# Altium project SkyDriver飞行控制器-IMU板V2.PrjPCB
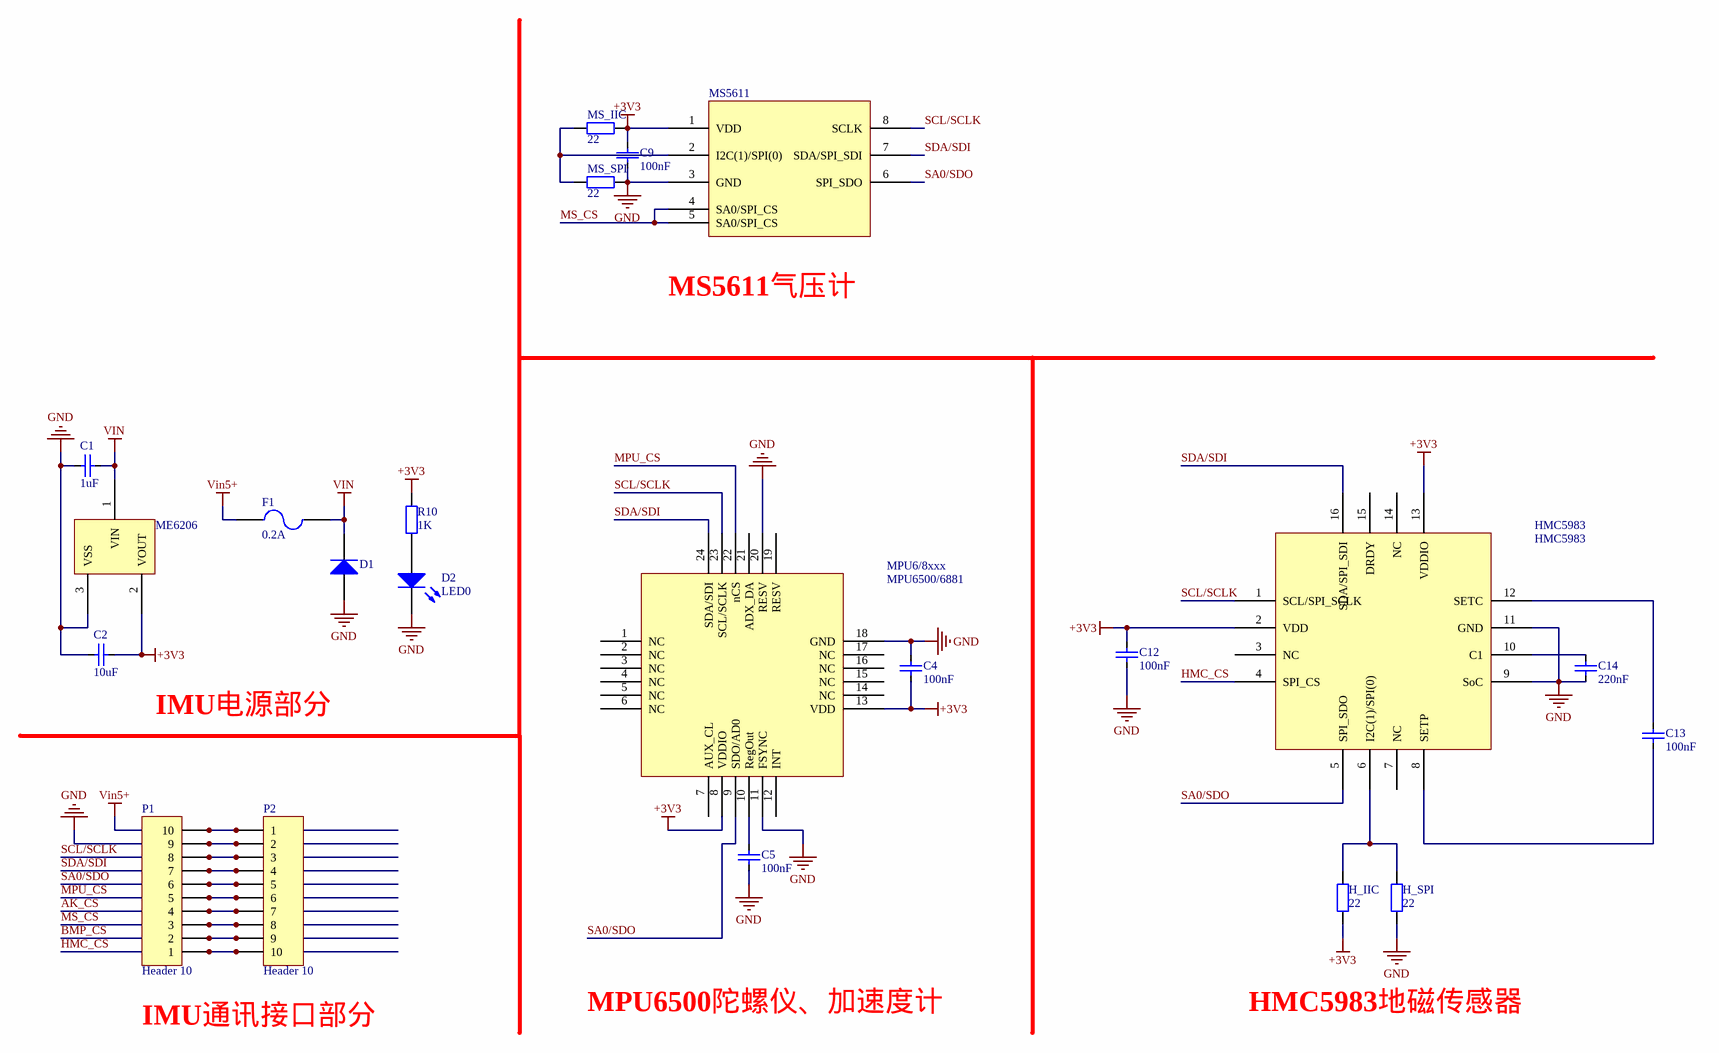
[diagram p0: SkyDriver飞行控制器-IMU板V2.SchDoc]
1 sheet, 22 parts. Net scope: global (net labels, ports and power ports of the same name join across sheets).
Board file: SkyDriver飞行控制器-IMU板V2.PcbDoc

## Sheet SkyDriver飞行控制器-IMU板V2.SchDoc
size A3

### Parts
C1  value 1uF  [CAP_0603]  (hidden comment: Cap_0603)
C2  value 10uF  [CAP_0603]  (hidden comment: Cap_0603)
C4  value 100nF  [CAP_0603]  (hidden comment: Cap_0603)
C5  value 100nF  [CAP_0603]  (hidden comment: Cap_0603)
C9  value 100nF  [CAP_0603]  (hidden comment: Cap_0603)
C12  value 100nF  [CAP_0603]  (hidden comment: Cap_0603)
C13  value 100nF  [CAP_0603]  (hidden comment: Cap_0603)
C14  value 220nF  [CAP_0603]  (hidden comment: Cap_0603)
D1  SS14  [SOD323]  (value not drawn)
D2  LED0  [LED_0805]
F1  value 0.2A  [0805s]  (hidden comment: Fuse)
H_IIC  value 22  [RES_0603]  (hidden comment: Res_0603)
H_SPI  value 22  [RES_0603]  (hidden comment: Res_0603)
HMC5983  HMC5983  [QFN16M - 3*3]
ME6206  ME6206  [sot23_M]  (value not drawn)
MPU6/8xxx  MPU6500/6881  [QFN24M - 3*3]
MS5611  MS5611  [QFN8 - MS5611]  (value not drawn)
MS_IIC  value 22  [RES_0603]  (hidden comment: Res_0603)
MS_SPI  value 22  [RES_0603]  (hidden comment: Res_0603)
P1  Header 10  [FPC0.5 - Header10]
P2  Header 10  [FPC0.5 - Header10]
R10  value 1K  [RES_0603]  (hidden comment: Res_0603)

### Nets
+3V3: C2.1 C4.1 C9.2 C12.2 H_IIC.1 HMC5983.2(VDD) HMC5983.13(VDDIO) ME6206.2(VOUT) MPU6/8xxx.8(VDDIO) MPU6/8xxx.13(VDD) MS5611.1(VDD) MS_IIC.1 R10.2
GND: C1.2 C2.2 C4.2 C5.1 C9.1 C12.1 C14.1 D1.2(A) D2.2(K) H_SPI.1 HMC5983.9(SoC) HMC5983.11(GND) ME6206.3(VSS) MPU6/8xxx.11(FSYNC) MPU6/8xxx.18(GND) MPU6/8xxx.20(RESV) MS5611.3(GND) MS_SPI.1 P1.9 P2.2
VIN: C1.1 D1.1(K) F1.2 ME6206.1(VIN)
Vin5+: F1.1 P1.10 P2.1
AK_CS: P1.4 P2.7
BMP_CS: P1.2 P2.9
HMC_CS: HMC5983.4(SPI_CS) P1.1 P2.10
MPU_CS: MPU6/8xxx.22(nCS) P1.5 P2.6
MS_CS: MS5611.4(SA0/SPI_CS) MS5611.5(SA0/SPI_CS) P1.3 P2.8
SA0/SDO: HMC5983.5(SPI_SDO) MPU6/8xxx.9(SDO/AD0) MS5611.6(SPI_SDO) P1.6 P2.5
SCL/SCLK: HMC5983.1(SCL/SPI_SCLK) MPU6/8xxx.23(SCL/SCLK) MS5611.8(SCLK) P1.8 P2.3
SDA/SDI: HMC5983.16(SDA/SPI_SDI) MPU6/8xxx.24(SDA/SDI) MS5611.7(SDA/SPI_SDI) P1.7 P2.4
NetC5_2: C5.2 MPU6/8xxx.10(RegOut)
NetC13_1: C13.1 HMC5983.8(SETP)
NetC13_2: C13.2 HMC5983.12(SETC)
NetC14_2: C14.2 HMC5983.10(C1)
NetD2_1: D2.1(A) R10.1
NetH_IIC_2: H_IIC.2 H_SPI.2 HMC5983.6(I2C(1)/SPI(0))
NetMS5611_2: MS5611.2(I2C(1)/SPI(0)) MS_IIC.2 MS_SPI.2

Not connected (* = marked no-connect by the designer): HMC5983 3(NC) 7(NC) 14(NC) 15(DRDY); MPU6/8xxx 1(NC) 2(NC) 3(NC) 4(NC) 5(NC) 6(NC) 7(AUX_CL) 12(INT) 14(NC) 15(NC) 16(NC) 17(NC) 19(RESV) 21(ADX_DA)

### Notes on the sheet
- (near MS5611) MS5611气压计
- IMU电源部分
- IMU通讯接口部分
- MPU6500陀螺仪、加速度计
- HMC5983地磁传感器

### Library data of the parts
C1 C2 C4 C5 C9 C12-C14 = Cap_0603: Capacitor
D1 = Diode 1N4007: 1 Amp General Purpose Rectifier; Published: 8-Jun-2000; LatestRevisionDate: 17-Jul-2002; LatestRevisionNote: Re-released for DXP Platform.; DatasheetVersion: 1998; PackageVersion: Aug-1999; PackageReference: DO-41; Publisher: Altium Limited; PackageDescription: Diode, Axial; Body 5.2 x 2.7 mm (LxDia. max), Lead Dia. 0.86 mm (max); Code_JEDEC: DO-204-AL; ComponentLink1Description: Manufacturer Link; ComponentLink1URL: http://www.fairchildsemi.com/; ComponentLink2Description: Datasheet; ComponentLink2URL: http://www.fairchildsemi.com/ds/1N%2F1N4001.pdf
D2 = LED0: Typical INFRARED GaAs LED; Published: 8-Jun-2000; LatestRevisionDate: 08-Jul-2005; LatestRevisionNote: Mech Layer 1 removed.; PackageReference: LED-0; Publisher: Altium Limited
F1 = Fuse 2: 保险丝; Published: 8-Jun-2000; LatestRevisionDate: 17-Jul-2002; LatestRevisionNote: Re-released for DXP Platform.; PackageReference: PIN-W2/E2.8; Publisher: Altium Limited
H_IIC H_SPI MS_IIC MS_SPI R10 = Res_0603: Resistor